# Altium schematic sheet Sensor_LM35.SchDoc
size 101 x 45 mm
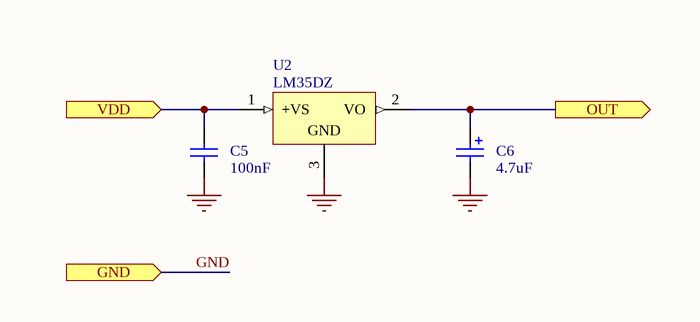
[diagram p0: Sensor_LM35.SchDoc]

## Parts
C5  value 100nF  [CAPNTO5.08-7.37x3.94]  (hidden comment: Cap)
C6  value 4.7uF  [CAPPR2.5-6.3x5]  (hidden comment: Cap Pol1)
U2  LM35DZ  [TO92C]

## Ports
GND (in), OUT (out), VDD (in)

## Nets
GND: C5.1 C6.2 U2.3(GND) ; port GND
OUT: C6.1 U2.2(VO) ; port OUT
VDD: C5.2 U2.1(+VS) ; port VDD

## Library data of the parts
C5 = Cap: Capacitor; Manufacturer: Generic Components; Class I: Passive; Published: 8-Jun-2000; Revision: July-2002: Re-released for DXP Platform.; Publisher: Altium Limited; Class II: Capacitor
C6 = Cap Pol1: Polarized Capacitor (Radial); Manufacturer: Generic Components; Class I: Passive; Published: 8-Jun-2000; Revision: July-2002: Re-released for DXP Platform.; Publisher: Altium Limited; Class II: Capacitor
U2 = LM35DZ: Precision Centigrade Temperature Sensor, 3-pin TO-92; Manufacturer: National Semiconductor; PackageTopMarking: NSXYTT*LM35*DZ; PowerWise: N; CompType: Temp Sensor IC; Published: 4-Dec-2008; LatestRevisionDate: 15-Jul-2009; LatestRevisionNote: Sch pins 1 & 3 reversed.; DatasheetVersion: Nov-2000; PackageVersion: revG, Sep-2000; PackageReference: Z03A; Publisher: Altium Limited; PackageDescription: TO-92, Molded, 3 Lead; Supplier 1: Farnell; Supplier Part Number 1: 9488200; PartNumber: LM35DZ; RoHS: N; PinCount: 3; Code_JEDEC: TO-226-AA; ComponentLink1Description: LM35 Datasheet; ComponentLink1URL: http://www.national.com/ds/LM/LM35.pdf; ComponentLink2Description: LM35 Web Page; ComponentLink2URL: http://www.national.com/pf/LM/LM35.html; ComponentLink3Description: Z03A Package Page; ComponentLink3URL: http://www.national.com/packaging/folders/z03a.html